# EAGLE design Debug_Breakout (EAGLE 7.7.0)
DOC_NUM: 1; REVISION: 1.0
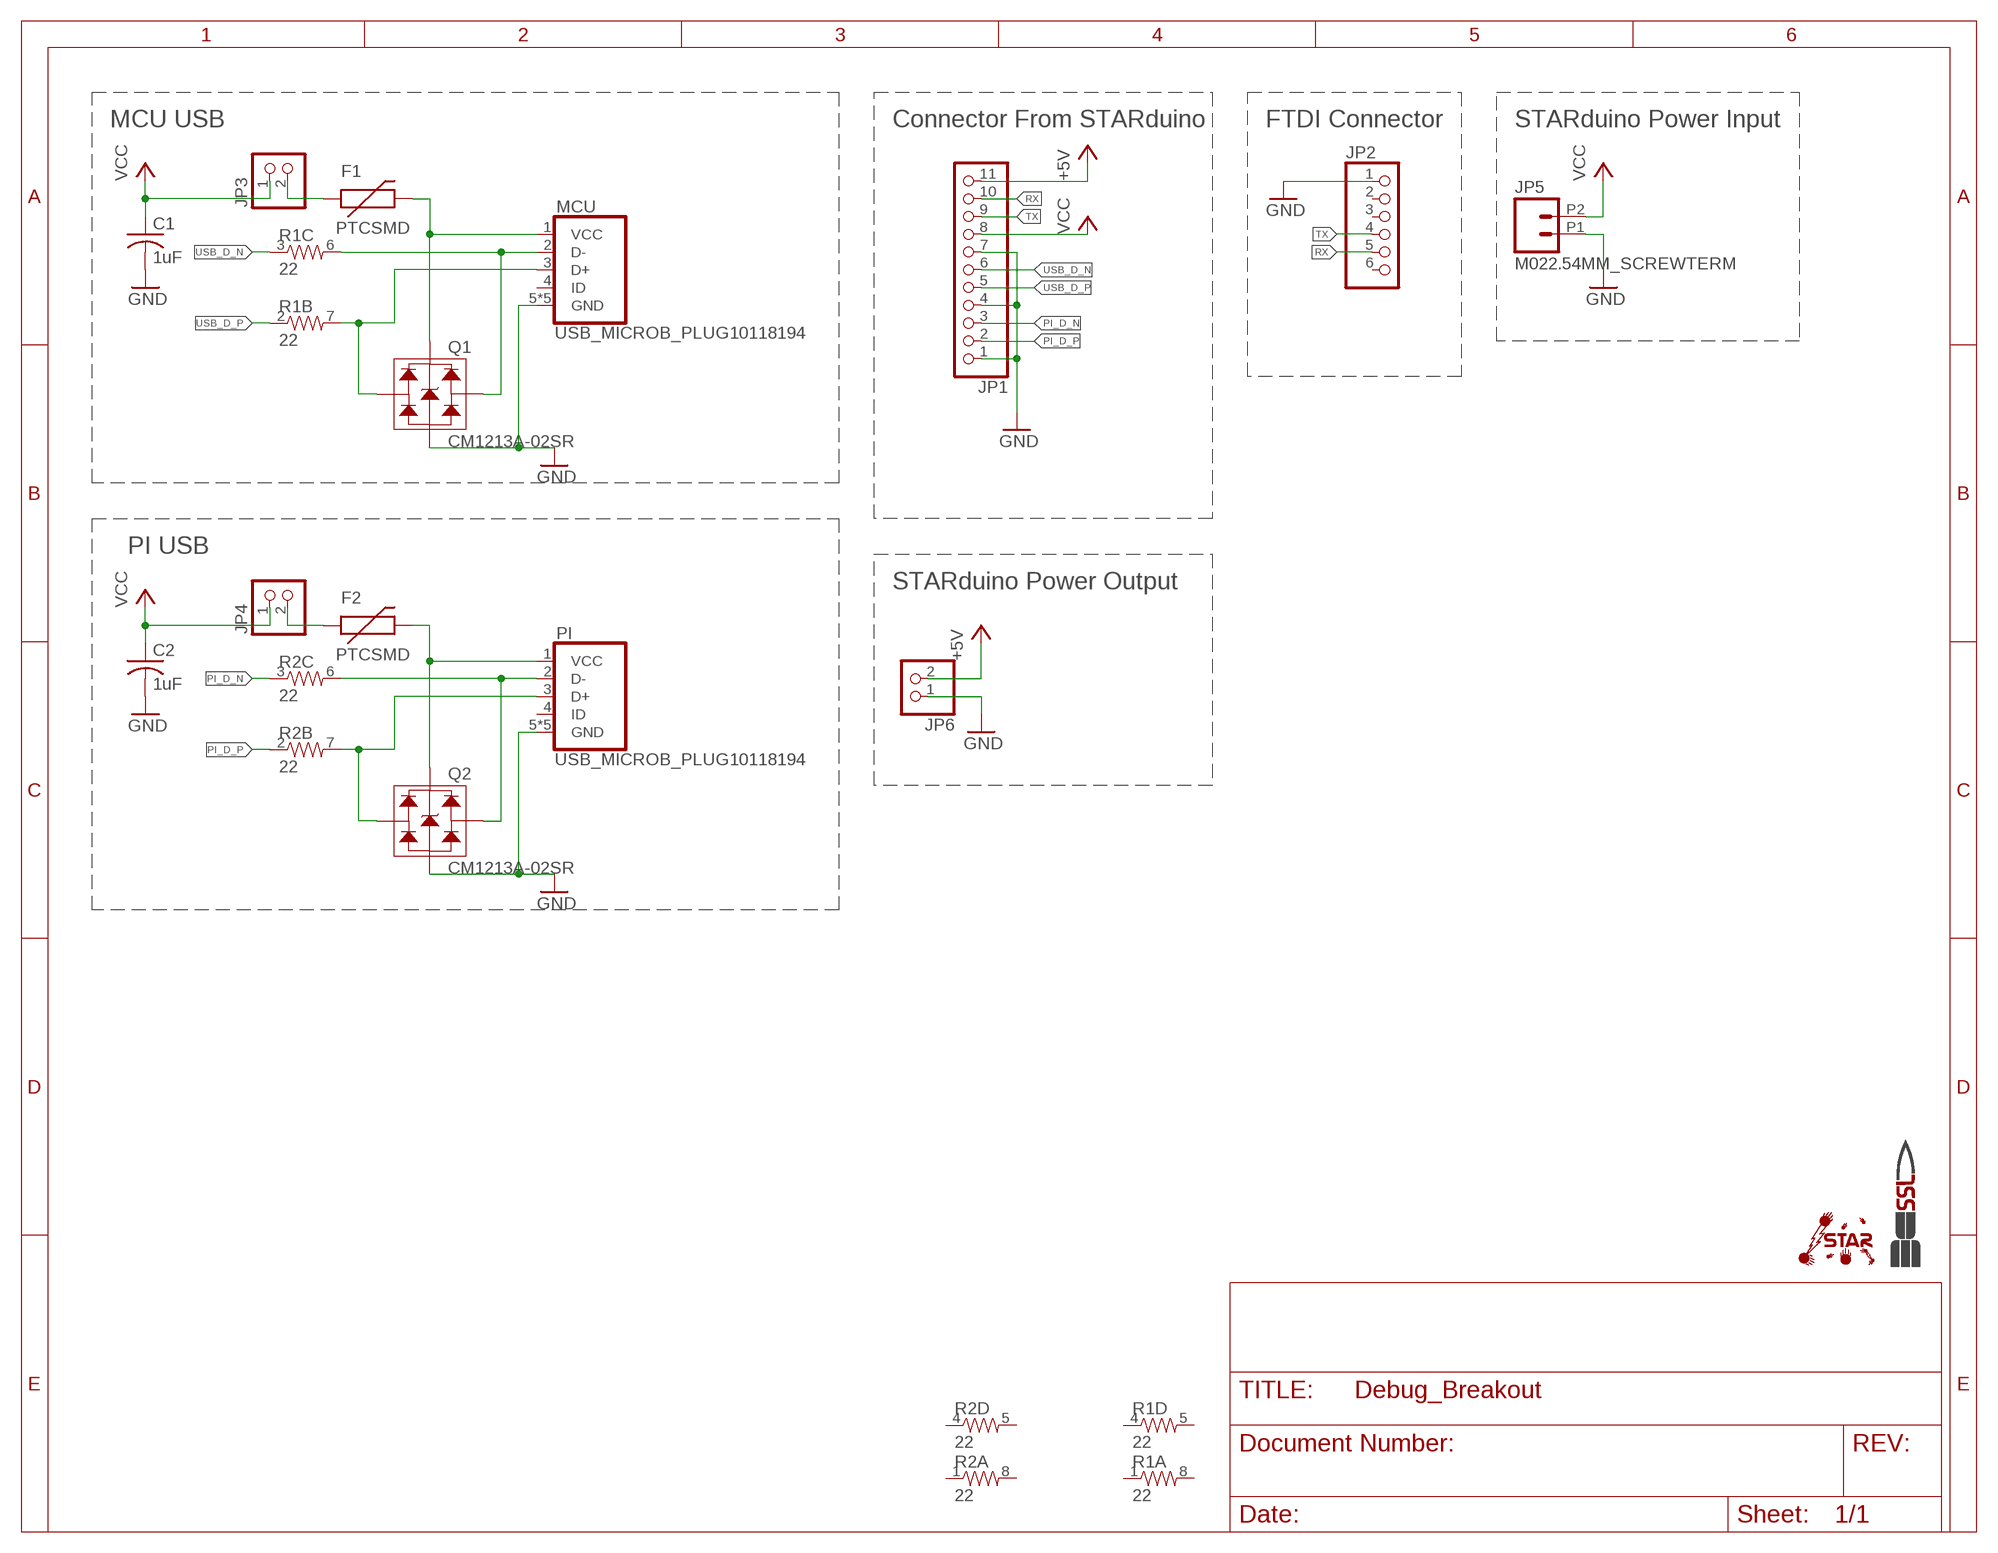
[diagram p0: schematic, sheet 1]

## Parts
C1  1uF  C-USC0603  [C0603]
C2  1uF  C-USC0603  [C0603]
F1  PTCSMD  [PTC-1206]
F2  PTCSMD  [PTC-1206]
JP1  PINHD-1X11  [1X11]
JP2  PINHD-1X6  [1X06]
JP3  PINHD-1X2  [1X02]
JP4  PINHD-1X2  [1X02]
JP5  M022.54MM_SCREWTERM  [1X02_2.54_SCREWTERM]
JP6  PINHD-1X2  [1X02]
MCU  USB_MICROB_PLUG10118194  [MICRO-B-10118194]
PI  USB_MICROB_PLUG10118194  [MICRO-B-10118194]
Q1  CM1213A-02SR  [SOT143-4]
Q2  CM1213A-02SR  [SOT143-4]
R1  22  RESISTOR-ARRAY0603-ARV  [0603-ARV]
R2  22  RESISTOR-ARRAY0603-ARV  [0603-ARV]
U$1  SSL.3IN_SILK  [SSL_SILK_.3IN]
U$2  STAR  [STAR_.3IN]

## Nets
+5V: JP1.11 JP6.2
GND: C1.2 C2.2 JP1.1 JP1.4 JP1.7 JP2.1 JP5.P1 JP6.1 MCU.5(GND) MCU.S1(GND) MCU.S2(GND) MCU.S3(GND) MCU.S4(GND) PI.5(GND) PI.S1(GND) PI.S2(GND) PI.S3(GND) PI.S4(GND) Q1.P$1(GND) Q2.P$1(GND)
MCU_D_N: MCU.2(D-) Q1.P$3(CH2) R1.6
MCU_D_P: MCU.3(D+) Q1.P$2(CH1) R1.7
N$5: F2.2 PI.1(VCC) Q2.P$4(VCC)
N$8: F1.2 MCU.1(VCC) Q1.P$4(VCC)
N$9: F2.1 JP4.2
N$10: F1.1 JP3.2
PI_D_N: JP1.3 R2.3
PI_D_P: JP1.2 R2.2
PICONN_D_N: PI.2(D-) Q2.P$3(CH2) R2.6
PICONN_D_P: PI.3(D+) Q2.P$2(CH1) R2.7
RX: JP1.10 JP2.5
TX: JP1.9 JP2.4
USB_D_N: JP1.6 R1.3
USB_D_P: JP1.5 R1.2
VCC: C1.1 C2.1 JP1.8 JP3.1 JP4.1 JP5.P2
Unconnected: JP2.2 JP2.3 JP2.6 MCU.4(ID) PI.4(ID) R1.1 R1.4 R1.5 R1.8 R2.1 R2.4 R2.5 R2.8

## Notes on the sheet
- MCU USB | Connector From STARduino | FTDI Connector | STARduino Power Input
- PI USB
- STARduino Power Output

## Library data of the parts
C1 C2 = resistor:C-US: CAPACITOR, American symbol
F1 F2 = CM_passives:PTC: Resettable Fuse PTC Resettable Fuse. Spark Fun Electronics SKU : COM-08357; PROD_ID: RES-11150
JP1 = pinhead:PINHD-1X11: PIN HEADER
JP2 = pinhead:PINHD-1X6: PIN HEADER
JP3 JP4 JP6 = pinhead:PINHD-1X2: PIN HEADER
JP5 = CM_connectors:M02: Standard 2-pin 0.1" header. Use with - straight break away headers ( PRT-00116) - right angle break away headers (PRT-00553) - swiss pins (PRT-00743) - machine pins (PRT-00117) - female headers (PRT-00115) Molex polarized connector foot print use with: PRT-08233 with associated crimp pins and housings. 2.54_SCREWTERM for use with PRT-10571. 3.5mm Screw Terminal footprints for PRT-08084 5mm Screw Terminal footprints for use with PRT-08433
MCU PI = CM_connectors:USB_MICROB_PLUG: USB Micro-B Plug Comes in a variety of packages. Check out Hirose's ZX-x0 line: http://www.hirose.co.jp/cataloge_hp/e24200011.pdf
Q1 Q2 = CM_IC:CM1213A
R1 R2 = SparkFun-Passives:RESISTOR-ARRAY: Array Chip Resistor Source: RS Component / Phycomp
U$1 = images:SSL
U$2 = images:STAR

## Board
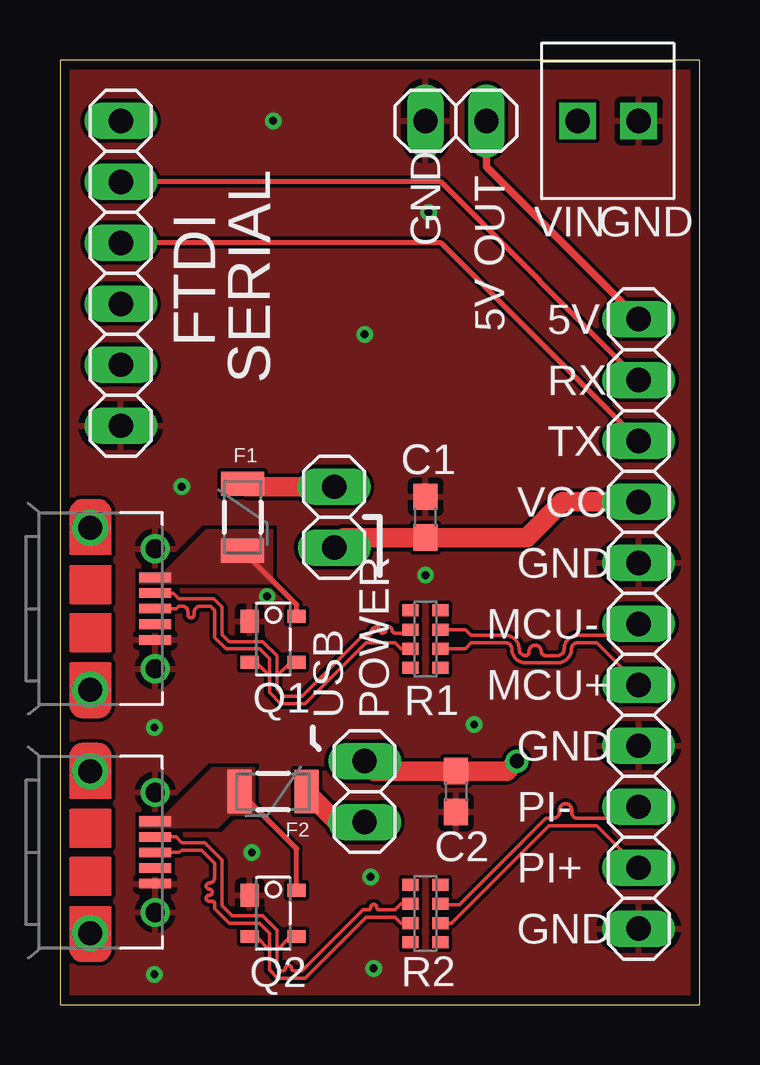
[diagram p1: board, top side]
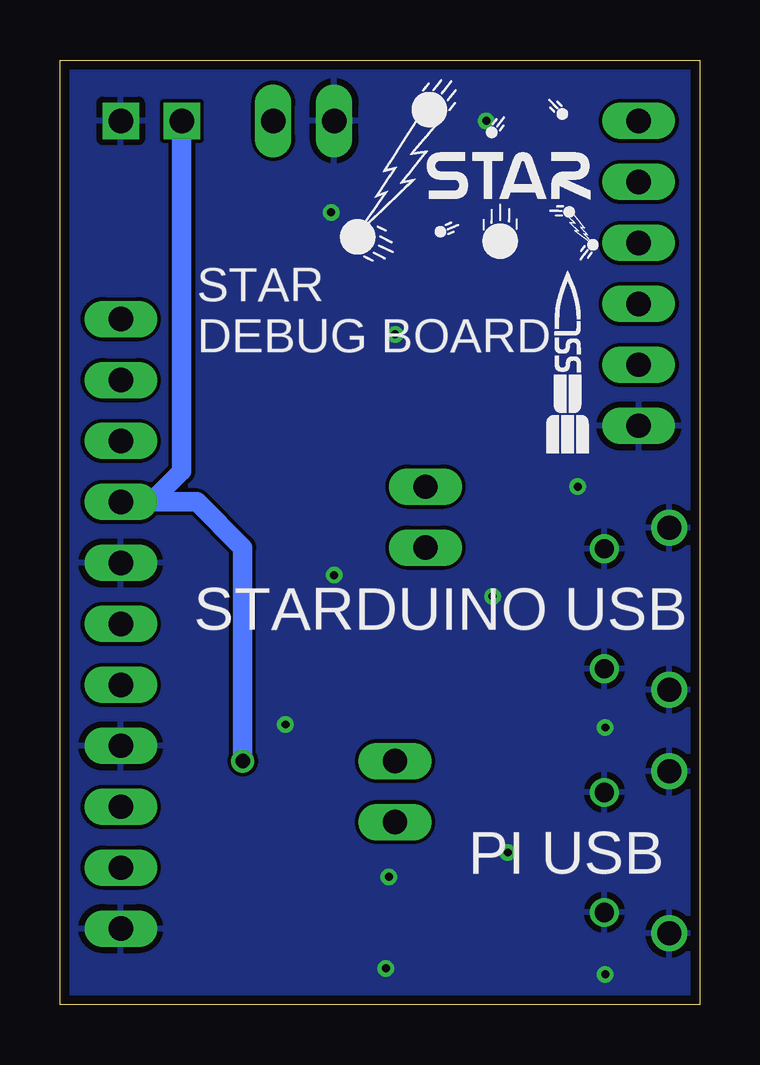
[diagram p2: board, bottom side, seen from below]

Size 26.67 x 39.37 mm. Coordinates in mm from the lower left corner, seen from the top.
Outline: 0,0 26.67,0 26.67,39.37 0,39.37 0,0
Copper layers (1*16): Top 0.0356mm / dielectric 1.5011mm / Bottom 0.0356mm
Design rules "oshpark-2layer *": minimum track width 6mil, minimum drill 13mil, track to track 6mil, track to pad 6mil, pad to pad 6mil, via to via 6mil, smd to smd 6mil, copper to edge 15mil, drill to drill 6mil, minimum pad ring 7mil, minimum via ring 7mil, stop-mask expansion 2.5mil, vias tented up to drill 25mil, thermal gap 10mil

### Footprints (pad centres in the part's own frame; a part is rotated, then mirrored left to right if it is on the bottom)
C0603 = smd 1.1 x 1: 1 -0.85,0; 2 0.85,0
PTC-1206 = smd 1 x 1.8: 1 -1.4,0; 2 1.4,0
1X11 = drill 1.016 long: 1 -12.7,0; 2 -10.16,0; 3 -7.62,0; 4 -5.08,0; 5 -2.54,0; 6 0,0; 7 2.54,0; 8 5.08,0; 9 7.62,0; 10 10.16,0; 11 12.7,0
1X06 = drill 1.016 long: 1 -6.35,0; 2 -3.81,0; 3 -1.27,0; 4 1.27,0; 5 3.81,0; 6 6.35,0
1X02 = drill 1.016 long: 1 -1.27,0; 2 1.27,0
1X02_2.54_SCREWTERM = drill 1.016 square: P1 2.54,0; P2 0,0
MICRO-B-10118194 = smd 0.4 x 1.35: 1 -1.3,2.7; 2 -0.65,2.7; 3 0,2.7; 4 0.65,2.7; 5 1.3,2.7 | drill 1: S1 3.375,0; S2 -3.375,0 | drill 0.8: S3 -2.5,2.7; S4 2.5,2.7
SOT143-4 = smd 0.96 x 0.75: P$1 -0.75,-0.975 | smd 0.54 x 0.75: P$2 0.96,-0.975; P$3 0.96,0.975; P$4 -0.96,0.975
0603-ARV = smd 0.5 x 0.65: 1 -1.2,-0.625; 2 -0.4,-0.625; 3 0.4,-0.625; 4 1.2,-0.625; 5 1.2,0.625; 6 0.4,0.625; 7 -0.4,0.625; 8 -1.2,0.625

### Placement (x,y rotation side)
C1  15.24,20.32 90 top
C2  16.51,8.89 270 top
F1  7.62,20.32 270 top
F2  8.89,8.89 180 top
JP1  24.13,15.88 90 top
JP2  2.54,30.48 90 top
JP3  11.43,20.32 90 top
JP4  12.7,8.89 270 top
JP5  21.59,36.83 0 top
JP6  16.51,36.83 0 top
MCU  1.27,16.51 270 top
PI  1.27,6.35 270 top
Q1  8.89,15.24 270 top
Q2  8.89,3.81 270 top
R1  15.24,15.24 90 top
R2  15.24,3.81 90 top
U$1  6.73,22.99 0 bottom
U$2  14.99,30.99 0 bottom

### Tracks (layer width: path | path; a pad name or v marks a point on that pad's centre or on a via)
+5V
  Top 0.305: JP1.11 17.78,34.92 JP6.2
GND  (via drill 0.33)
  other vias: 8.89,36.83 15.37,33.02 12.7,27.94 5.08,21.59 15.24,17.91 8.64,17.02 3.94,11.56 17.27,11.68 12.95,5.33 8,6.35 3.94,1.27 13.08,1.52
  pour Top (rank 6): 0,41.91 34.29,41.91 34.29,-2.54 -2.54,-2.54 -2.54,34.29
  pour Bottom: -1.27,41.91 34.29,41.91 34.29,-2.54 -2.54,-2.54 -2.54,34.29
MCU_D_N
  Top 0.152: 9.04,13.72 9.04,13.14 9.33,12.85 10.1,12.85 12.64,15.39 12.85,15.39 arc90 12.95,15.49 arc-90 13.21,15.75 arc-90 13.34,15.62 arc90 13.46,15.49 arc90 13.59,15.62 arc-90 13.72,15.75 arc-90 13.84,15.62 arc90 13.97,15.49 14.47,15.49 R1.6 | 9.04,13.72 9.61,14.28 Q1.P$3 | 9.04,13.72 9.04,14.54 8.45,15.14 7.05,15.14 6.76,15.43 6.76,16.57 6.41,16.92 4.95,16.92 4.71,17.16 MCU.2
MCU_D_P
  Top 0.152: R1.7 14.22,14.84 13.97,15.09 12.76,15.09 10.22,12.55 9.21,12.55 8.74,13.02 8.74,13.72 | 8.74,13.72 8.17,14.28 Q1.P$2 | MCU.3 4.85,16.51 4.95,16.61 5.11,16.61 arc-90 5.33,16.38 5.33,16.26 arc90 5.46,16.13 arc90 5.59,16.26 5.59,16.36 arc-90 5.84,16.61 6.29,16.61 6.45,16.45 6.45,15.3 6.92,14.83 8.32,14.83 8.74,14.41 8.74,13.72
N$5
  Top 0.203: Q2.P$4 9.87,6.51 F2.2
  pour Top (no thermals): 3.3,7.62 3.3,7.37 6.6,7.37 7.11,7.87 8.13,7.87 8.13,9.91 6.35,9.91 4.32,7.87 3.3,7.87
N$8
  Top 0.203: Q1.P$4 9.87,16.68 F1.2
  pour Top (no thermals): 4.57,17.53 8.89,17.53 8.89,19.81 6.1,19.81 4.57,18.29 4.32,18.03 3.3,18.03 3.3,17.53
N$9
  Top 0.813: F2.1 11.56,7.62 JP4.2
N$10
  Top 0.508: F1.1 7.75,21.59
  Top 0.813: 7.75,21.59 JP3.2
PI_D_N
  Top 0.152: JP1.3 23.65,7.77 21.59,7.77 arc-90 21.34,8.03 21.34,8.13 arc90 21.08,8.38 arc90 20.83,8.13 20.83,8.03 arc-90 20.57,7.77 20.26,7.77 16.66,4.17 15.9,4.17 R2.3
PI_D_P
  Top 0.152: JP1.2 22.38,7.47 20.38,7.47 16.33,3.41 R2.2
PICONN_D_N
  Top 0.152: R2.6 14.22,4.21 13.97,3.96 13.31,3.96 arc-90 13.21,4.06 arc90 13.08,4.19 arc90 12.95,4.06 arc-90 12.85,3.96 12.64,3.96 10.1,1.42 9.75,1.42 arc-90 9.65,1.52 arc90 9.53,1.65 arc90 9.4,1.52 arc-90 9.3,1.42 9.21,1.42 9.04,1.59 9.04,2.29 | 9.04,2.29 9.61,2.85 Q2.P$3 | PI.2 4.84,7 5.08,6.76 6.03,6.76 6.76,6.03 6.76,4.13 7.17,3.71 8.45,3.71 9.04,3.11 9.04,2.29
PICONN_D_P
  Top 0.152: R2.7 14.22,3.41 13.97,3.66 12.76,3.66 10.22,1.12 9.08,1.12 8.74,1.46 8.74,2.29 | 8.74,2.29 8.17,2.85 Q2.P$2 | PI.3 4.98,6.35 5.08,6.45 5.91,6.45 6.45,5.91 6.45,5.31 arc-90 6.22,5.08 arc90 6.1,4.95 arc90 6.22,4.83 arc-90 6.35,4.7 arc-90 6.22,4.57 arc90 6.1,4.45 arc90 6.22,4.32 6.35,4.32 arc-90 6.45,4.22 6.45,4 7.05,3.4 8.32,3.4 8.74,2.98 8.74,2.29
RX
  Top 0.203: JP1.10 15.88,34.29 JP2.5
TX
  Top 0.203: JP1.9 15.88,31.75 JP2.4
USB_D_N
  Top 0.152: JP1.6 23.65,15.39 21.59,15.39 arc90 21.02,14.82 arc-90 20.75,14.55 20.24,14.55 arc-90 20.07,14.73 arc90 19.81,14.99 arc90 19.56,14.73 19.56,14.7 arc-90 19.41,14.55 arc-90 19.15,14.82 arc90 18.57,15.39 17.14,15.39 16.9,15.64 R1.3
USB_D_P
  Top 0.152: JP1.5 22.38,15.09 21.59,15.09 arc90 21.32,14.82 arc-90 20.75,14.25 19.41,14.25 arc-90 18.84,14.82 arc90 18.57,15.09 17.14,15.09 16.9,14.84 R1.2
VCC  (via drill 0.6)
  Top 0.813: JP1.8 20.95,20.95 19.47,19.47 C1.1 11.85,19.47 JP3.1 | JP4.1 13.12,9.74 C2.1 18.63,9.74 v19.05,10.16
  Bottom 0.813: JP5.P2 21.59,22.23 22.86,20.95 | v19.05,10.16 19.05,19.05 20.95,20.95 22.86,20.95 | 22.86,20.95 JP1.8

### Text on the board
tPlace: VIN | GND | GND | 5V OUT | 5V | FTDI | SERIAL | RX | TX | VCC | GND | MCU- | MCU+ | USB / POWER | GND | PI- | PI+ | GND
bPlace: STAR / DEBUG BOARD | STARDUINO USB | PI USB